# Altium schematic sheet 门禁控制器顶层设计.SchDoc
size A4
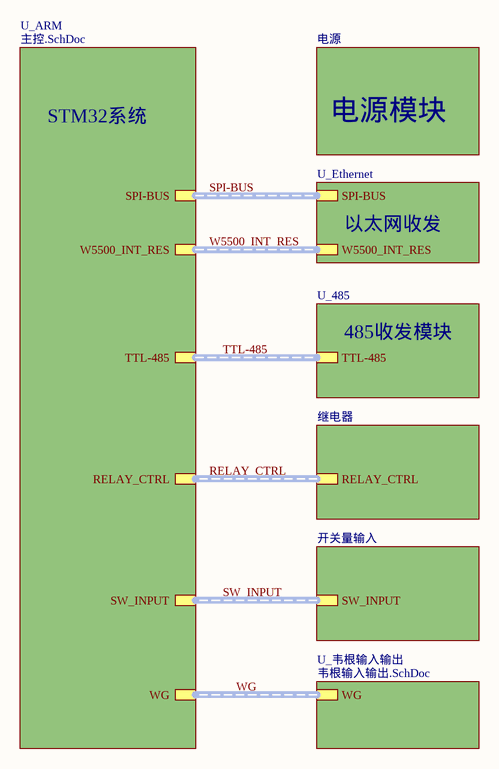
[diagram p0: 门禁控制器顶层设计.SchDoc]

## Sub-sheets
U_485 = 485.SchDoc: TTL-485 (harness TTL转485)
U_ARM = 主控.SchDoc: SPI-BUS (harness SPI总线), W5500_INT_RES (harness W5500_INT_RES), TTL-485 (harness TTL转485), RELAY_CTRL, SW_INPUT, WG
U_Ethernet = TCP_IP.SchDoc: SPI-BUS, W5500_INT_RES
U_韦根输入输出 = 韦根输入输出.SchDoc: WG (harness 韦根)
开关量输入 = 开关量输入.SchDoc: SW_INPUT (harness TTL转485)
电源 = 电源.SchDoc: no entries
继电器 = 继电器.SchDoc: RELAY_CTRL (harness TTL转485)

## Buses and harness runs
harness RELAY_CTRL = sheet U_ARM/RELAY_CTRL = sheet 继电器/RELAY_CTRL
harness SPI-BUS = sheet U_ARM/SPI-BUS = sheet U_Ethernet/SPI-BUS
harness SW_INPUT = sheet U_ARM/SW_INPUT = sheet 开关量输入/SW_INPUT
harness TTL-485 = sheet U_485/TTL-485 = sheet U_ARM/TTL-485
harness W5500_INT_RES = sheet U_ARM/W5500_INT_RES = sheet U_Ethernet/W5500_INT_RES
harness WG = sheet U_ARM/WG = sheet U_韦根输入输出/WG

## Notes on the sheet
- STM32系统
- 电源模块
- 以太网收发
- 485收发模块